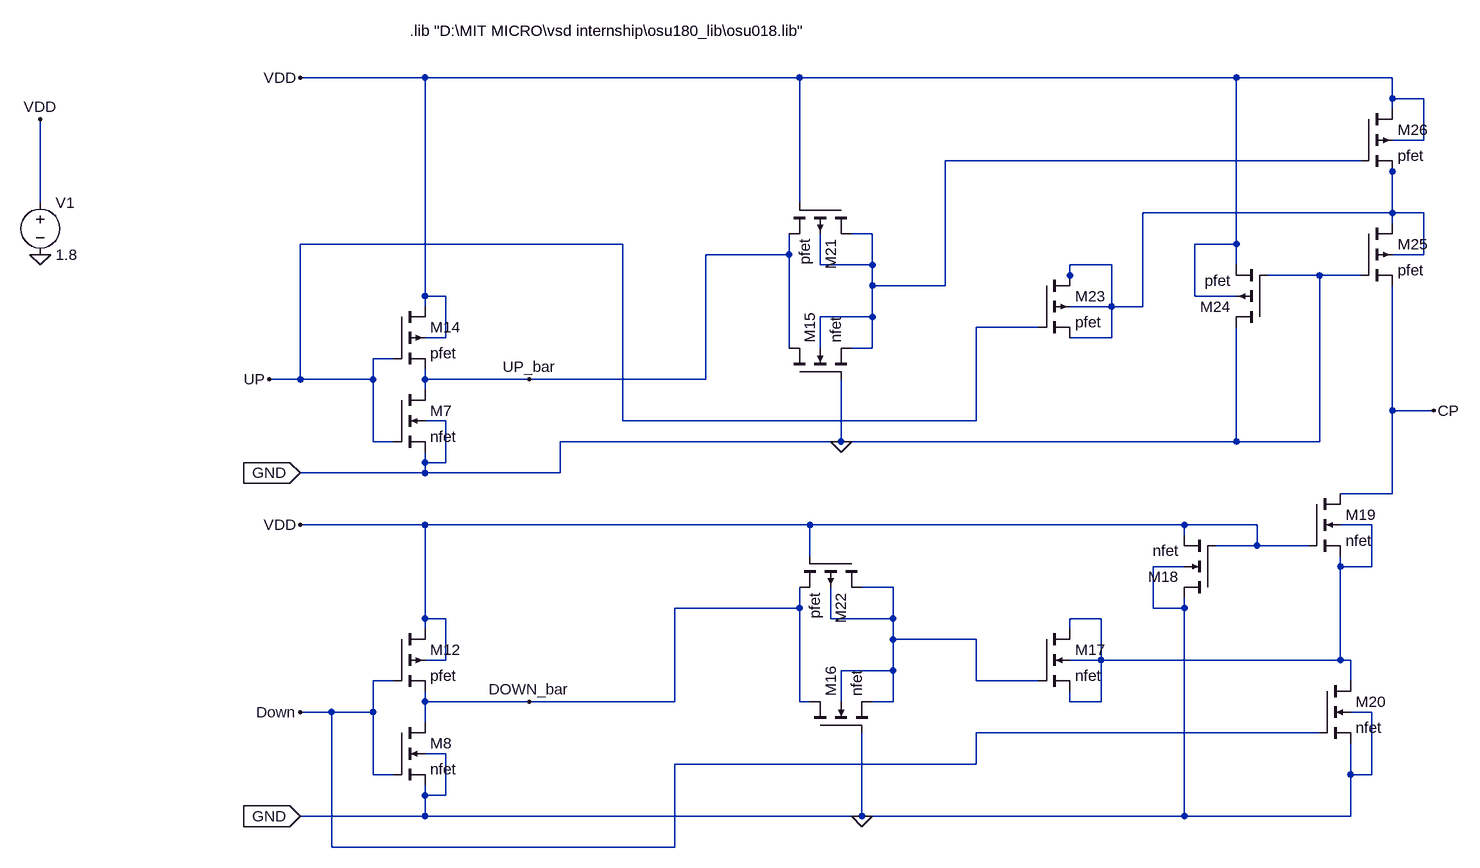
[diagram p0: schematic charge_pump.asc]
charge_pump.asc, the LTspice schematic file:
Version 4
SHEET 1 2360 948
WIRE 496 -288 304 -288
WIRE 1072 -288 496 -288
WIRE 1744 -288 1072 -288
WIRE 1984 -288 1744 -288
WIRE 1984 -256 1984 -288
WIRE 2032 -256 1984 -256
WIRE 1984 -240 1984 -256
WIRE 2032 -192 2032 -256
WIRE 2032 -192 1984 -192
WIRE 1936 -160 1296 -160
WIRE 1984 -144 1984 -160
WIRE -96 -96 -96 -224
WIRE 1072 -96 1072 -288
WIRE 1984 -80 1984 -144
WIRE 1984 -80 1600 -80
WIRE 2032 -80 1984 -80
WIRE 1984 -64 1984 -80
WIRE 1184 -48 1152 -48
WIRE 800 -32 304 -32
WIRE 1744 -32 1744 -288
WIRE 1744 -32 1680 -32
WIRE 1056 -16 1056 -48
WIRE 1056 -16 928 -16
WIRE 2032 -16 2032 -80
WIRE 2032 -16 1984 -16
WIRE 1104 0 1104 -48
WIRE 1184 0 1184 -48
WIRE 1184 0 1104 0
WIRE 1552 0 1488 0
WIRE 1744 0 1744 -32
WIRE 1488 16 1488 0
WIRE 1872 16 1792 16
WIRE 1936 16 1872 16
WIRE 1184 32 1184 0
WIRE 1296 32 1296 -160
WIRE 1296 32 1184 32
WIRE 1488 32 1488 16
WIRE 496 48 496 -288
WIRE 528 48 496 48
WIRE 1680 48 1680 -32
WIRE 1744 48 1680 48
WIRE 496 64 496 48
WIRE 1552 64 1552 0
WIRE 1552 64 1488 64
WIRE 1600 64 1600 -80
WIRE 1600 64 1552 64
WIRE 1184 80 1184 32
WIRE 1184 80 1104 80
WIRE 1440 96 1344 96
WIRE 528 112 528 48
WIRE 528 112 496 112
WIRE 1552 112 1552 64
WIRE 1552 112 1488 112
WIRE 1056 128 1056 -16
WIRE 1104 128 1104 80
WIRE 1184 128 1184 80
WIRE 1184 128 1152 128
WIRE 448 144 416 144
WIRE 304 176 304 -32
WIRE 304 176 256 176
WIRE 416 176 416 144
WIRE 416 176 304 176
WIRE 496 176 496 160
WIRE 656 176 496 176
WIRE 928 176 928 -16
WIRE 928 176 656 176
WIRE 496 192 496 176
WIRE 1984 224 1984 32
WIRE 2048 224 1984 224
WIRE 528 240 496 240
WIRE 800 240 800 -32
WIRE 1344 240 1344 96
WIRE 1344 240 800 240
WIRE 416 272 416 176
WIRE 448 272 416 272
WIRE 1136 272 1136 176
WIRE 1136 272 704 272
WIRE 1744 272 1744 96
WIRE 1744 272 1136 272
WIRE 1872 272 1872 16
WIRE 1872 272 1744 272
WIRE 496 304 496 288
WIRE 528 304 528 240
WIRE 528 304 496 304
WIRE 496 320 496 304
WIRE 496 320 304 320
WIRE 704 320 704 272
WIRE 704 320 496 320
WIRE 1984 352 1984 224
WIRE 1984 352 1904 352
WIRE 496 400 304 400
WIRE 1088 400 496 400
WIRE 1664 400 1088 400
WIRE 1776 400 1664 400
WIRE 1952 400 1904 400
WIRE 1664 416 1664 400
WIRE 1776 432 1776 400
WIRE 1776 432 1712 432
WIRE 1856 432 1776 432
WIRE 1088 448 1088 400
WIRE 1664 464 1616 464
WIRE 1904 464 1904 448
WIRE 1952 464 1952 400
WIRE 1952 464 1904 464
WIRE 1216 496 1168 496
WIRE 1072 528 1072 496
WIRE 1072 528 880 528
WIRE 1616 528 1616 464
WIRE 1664 528 1664 512
WIRE 1664 528 1616 528
WIRE 496 544 496 400
WIRE 528 544 496 544
WIRE 1120 544 1120 496
WIRE 1216 544 1216 496
WIRE 1216 544 1120 544
WIRE 1536 544 1488 544
WIRE 496 560 496 544
WIRE 1488 560 1488 544
WIRE 1216 576 1216 544
WIRE 1344 576 1216 576
WIRE 528 608 528 544
WIRE 528 608 496 608
WIRE 1536 608 1536 544
WIRE 1536 608 1488 608
WIRE 1904 608 1904 464
WIRE 1904 608 1536 608
WIRE 1920 608 1904 608
WIRE 1216 624 1216 576
WIRE 1216 624 1136 624
WIRE 448 640 416 640
WIRE 1344 640 1344 576
WIRE 1440 640 1344 640
WIRE 1920 640 1920 608
WIRE 496 672 496 656
WIRE 656 672 496 672
WIRE 880 672 880 528
WIRE 880 672 656 672
WIRE 1072 672 1072 528
WIRE 1088 672 1072 672
WIRE 1136 672 1136 624
WIRE 1216 672 1216 624
WIRE 1216 672 1184 672
WIRE 1488 672 1488 656
WIRE 1536 672 1536 608
WIRE 1536 672 1488 672
WIRE 352 688 304 688
WIRE 416 688 416 640
WIRE 416 688 352 688
WIRE 1952 688 1920 688
WIRE 496 704 496 672
WIRE 1872 720 1344 720
WIRE 528 752 496 752
WIRE 1344 768 1344 720
WIRE 1344 768 880 768
WIRE 416 784 416 688
WIRE 448 784 416 784
WIRE 1920 784 1920 736
WIRE 1952 784 1952 688
WIRE 1952 784 1920 784
WIRE 496 816 496 800
WIRE 528 816 528 752
WIRE 528 816 496 816
WIRE 496 848 496 816
WIRE 496 848 304 848
WIRE 1168 848 1168 720
WIRE 1168 848 496 848
WIRE 1664 848 1664 528
WIRE 1664 848 1168 848
WIRE 1920 848 1920 784
WIRE 1920 848 1664 848
WIRE 352 896 352 688
WIRE 880 896 880 768
WIRE 880 896 352 896
FLAG 656 176 UP_bar
FLAG 656 672 DOWN_bar
FLAG 2048 224 CP
FLAG 304 688 Down
FLAG 304 400 VDD
FLAG 304 -288 VDD
FLAG 304 848 GND
IOPIN 304 848 In
FLAG 304 320 GND
IOPIN 304 320 In
FLAG 256 176 UP
FLAG -96 -16 0
FLAG -96 -224 VDD
FLAG 1136 272 0
FLAG 1168 848 0
SYMBOL nmos4 448 192 R0
SYMATTR InstName M7
SYMATTR Value2 l=180n w=180n
SYMATTR Value nfet
SYMBOL nmos4 448 704 R0
SYMATTR InstName M8
SYMATTR Value2 l=180n w=180n
SYMATTR Value nfet
SYMBOL pmos4 448 560 R0
SYMATTR InstName M12
SYMATTR Value2 l=180n w=540n
SYMATTR Value pfet
SYMBOL pmos4 448 64 R0
SYMATTR InstName M14
SYMATTR Value2 l=180n w=540n
SYMATTR Value pfet
SYMBOL nmos4 1056 176 R270
SYMATTR InstName M15
SYMATTR Value nfet
SYMATTR Value2 l=180n w=180n
SYMBOL nmos4 1088 720 R270
SYMATTR InstName M16
SYMATTR Value nfet
SYMATTR Value2 l=180n w=180n
SYMBOL nmos4 1440 560 R0
SYMATTR InstName M17
SYMATTR Value nfet
SYMATTR Value2 l=180n w=180n
SYMBOL nmos4 1712 512 R180
SYMATTR InstName M18
SYMATTR Value nfet
SYMATTR Value2 l=180n w=180n
SYMBOL nmos4 1856 352 R0
SYMATTR InstName M19
SYMATTR Value nfet
SYMATTR Value2 l=180n w=180n
SYMBOL nmos4 1872 640 R0
SYMATTR InstName M20
SYMATTR Value nfet
SYMATTR Value2 l=180n w=15u
SYMBOL pmos4 1152 -96 R90
SYMATTR InstName M21
SYMATTR Value pfet
SYMATTR Value2 l=180n w=540n
SYMBOL pmos4 1168 448 R90
SYMATTR InstName M22
SYMATTR Value pfet
SYMATTR Value2 l=180n w=540n
SYMBOL pmos4 1440 16 R0
SYMATTR InstName M23
SYMATTR Value pfet
SYMATTR Value2 l=180n w=540n
SYMBOL pmos4 1792 96 R180
SYMATTR InstName M24
SYMATTR Value pfet
SYMATTR Value2 l=180n w=540n
SYMBOL pmos4 1936 -64 R0
SYMATTR InstName M25
SYMATTR Value pfet
SYMATTR Value2 l=180n w=540n
SYMBOL pmos4 1936 -240 R0
SYMATTR InstName M26
SYMATTR Value pfet
SYMATTR Value2 l=180n w=45u
SYMBOL voltage -96 -112 R0
WINDOW 123 0 0 Left 0
WINDOW 39 0 0 Left 0
SYMATTR InstName V1
SYMATTR Value 1.8
TEXT 472 -360 Left 2 !.lib "D:\\MIT MICRO\\vsd internship\\osu180_lib\\osu018.lib"

The netlist it stands for:
* charge_pump.asc
M7 UP_bar UP 0 0 nfet l=180n w=180n
M8 DOWN_bar Down 0 0 nfet l=180n w=180n
M12 VDD Down DOWN_bar VDD pfet l=180n w=540n
M14 VDD UP UP_bar VDD pfet l=180n w=540n
M15 UP_bar 0 N001 N001 nfet l=180n w=180n
M16 DOWN_bar 0 N004 N004 nfet l=180n w=180n
M17 N003 N004 N003 N003 nfet l=180n w=180n
M18 0 VDD VDD 0 nfet l=180n w=180n
M19 CP VDD N003 N003 nfet l=180n w=180n
M20 N003 Down 0 0 nfet l=180n w=15u
M21 N001 VDD UP_bar N001 pfet l=180n w=540n
M22 N004 VDD DOWN_bar N004 pfet l=180n w=540n
M23 N002 UP N002 N002 pfet l=180n w=540n
M24 0 0 VDD VDD pfet l=180n w=540n
M25 N002 0 CP N002 pfet l=180n w=540n
M26 VDD N001 N002 VDD pfet l=180n w=45u
V1 VDD 0 1.8
.model NMOS NMOS
.model PMOS PMOS
.lib standard.mos
.lib "D:\MIT MICRO\vsd internship\osu180_lib\osu018.lib"
.backanno
.end